# Altium project CG_65_PCB.PrjPcb
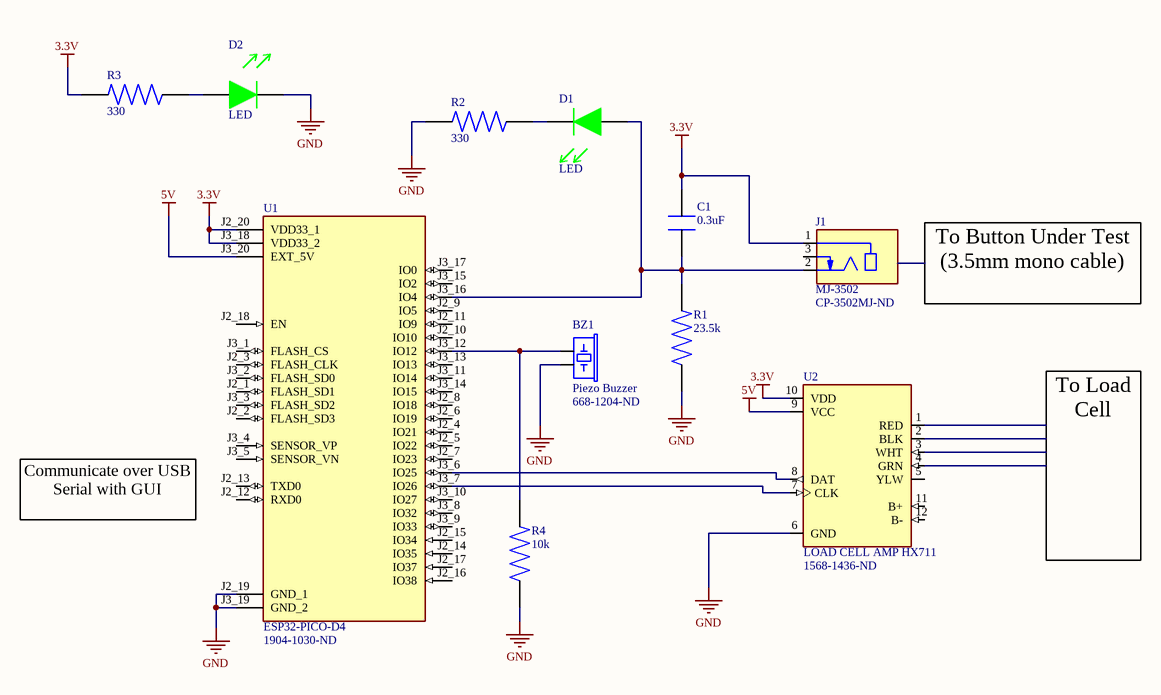
[diagram p0: pcb.SchDoc]
1 sheet, 11 parts. Net scope: global (net labels, ports and power ports of the same name join across sheets).

## Sheet pcb.SchDoc
size A4; SheetNumber: 1; SheetTotal: 1

### Parts
BZ1  Piezo Buzzer  Supplier Part Number 1: 668-1204-ND  [AI-3035-TWT-3V-R]
C1  0.3uF  [NET_TIE-12]
D1  LED  [NET_TIE-12]
D2  LED  [NET_TIE-12]
J1  MJ-3502  Supplier Part Number 1: CP-3502MJ-ND  [NET_TIE-12]
R1  23.5k  [NET_TIE-12]
R2  330  [NET_TIE-12]
R3  330  [NET_TIE-12]
R4  10k  [NET_TIE-12]
U1  ESP32-PICO-D4  Supplier Part Number 1: 1904-1030-ND
U2  LOAD CELL AMP HX711  Supplier Part Number 1: 1568-1436-ND

### Nets
3.3V: C1.0 J1.1 R3.2 U1.J2_20(VDD33_1) U1.J3_18(VDD33_2) U2.10(VDD)
5V: U1.J3_20(EXT_5V) U2.9(VCC)
GND: BZ1.P$3 D2.1 R1.1 R2.2 R4.1 U1.J2_19(GND_1) U1.J3_19(GND_2) U2.6(GND)
NetBZ1_P$2: BZ1.P$2 R4.2 U1.J3_12(IO12)
NetC1_1: C1.1 D1.0 J1.2 R1.2 U1.J3_16(IO4)
NetD1_1: D1.1 R2.1
NetD2_0: D2.0 R3.1
NetU1_J3_6: U1.J3_6(IO25) U2.8(DAT)
NetU1_J3_7: U1.J3_7(IO26) U2.7(CLK)

Not connected (* = marked no-connect by the designer): J1 3; U1 J2_1(FLASH_SD1) J2_2(FLASH_SD3) J2_3(FLASH_CLK) J2_4(IO21) J2_5(IO22) J2_6(IO19) J2_7(IO23) J2_8(IO18) J2_9(IO5) J2_10(IO10) J2_11(IO9) J2_12(RXD0) J2_13(TXD0) J2_14(IO35) J2_15(IO34) J2_16(IO38) J2_17(IO37) J2_18(EN) J3_1(FLASH_CS) J3_2(FLASH_SD0) J3_3(FLASH_SD2) J3_4(SENSOR_VP) J3_5(SENSOR_VN) J3_8(IO32) J3_9(IO33) J3_10(IO27) J3_11(IO14) J3_13(IO13) J3_14(IO15) J3_15(IO2) J3_17(IO0); U2 1(RED) 2(BLK) 3(WHT) 4(GRN) 5(YLW) 11(B+) 12(B-)

### Notes on the sheet
- To Button Under Test (3.5mm mono cable)
- Communicate over USB Serial with GUI
- To Load Cell

### Library data of the parts
BZ1 = BUZZER: Audio Indicator Piezo 2VDC 5VDC 9mA 3VDC 100dBAdBA 3000Hz to 4000Hz Through Hole Pin; Manufacturer: Projects Unlimited; Nominal Supply Voltage (DC): 3V; Frequency: 3.5kHz; Max Supply Voltage (DC): 5V; Min Supply Voltage (DC): 2V; Input Type: DC; Washable: Yes; Supplier 1: Digi-Key; Manufacturer Part Number: AI-3035-TWT-3V-R; RoHS: Yes; Category: Audio Products; Stock 1: 14193; Pricing 1: 1=2.78000, 10=2.30300, 25=2.12600, 50=1.99760, 100=1.87400, 450=1.60551, 950=1.58793 (USD); Mount: Through Hole; Contact Plating: Tin; Min Operating Temperature: -20°C; Max Operating Temperature: 80°C; Package Quantity: 50; Packaging: Tray; Voltage Rating (DC): 3V; Current Rating: 9mA; Operating Supply Current: 9mA; Termination: PC Pins; Max Supply Current: 9mA; Series: AI; Diameter: 30mm; Length: 30mm; Width: 30mm; Height: 20.5mm; ComponentLink1URL: https://datasheet.ciiva.com/8113/ai-3035-twt-3v-r-8113514.pdf?src-supplier=Avnet; ComponentLink1Description: https://datasheet.ciiva.com/8113/ai-3035-twt-3v-r-8113514.pdf?src-supplier=Avnet; ComponentLink2URL: https://datasheet.ciiva.com/4623/ai-3035-twt-3v-r-63144-4623167.pdf?src-supplier=Mouser; ComponentLink2Description: https://datasheet.ciiva.com/4623/ai-3035-twt-3v-r-63144-4623167.pdf?src-supplier=Mouser; ComponentLink3URL: https://datasheet.ciiva.com/0/ai-3035-twt-3v-r-348.pdf?src-supplier=Digi-Key; ComponentLink3Description: https://datasheet.ciiva.com/0/ai-3035-twt-3v-r-348.pdf?src-supplier=Digi-Key
C1 = CAP
J1 = MJ-3502: 3.5 mm, Mono, Right Angle, Through Hole, Threaded Bushing, Audio Jack Connector; Manufacturer: CUI; Body Material: Brass; Body Color: Black; Gender: Female; Shielding: Unshielded; Current Rating: 1A; Number of Conductors: 2; Number of Ports: 1; Supplier 1: Digi-Key; Manufacturer Part Number: MJ-3502; RoHS: Yes; Category: Uncategorized; Mount: Through Hole,Panel; Color: Black; Contact Plating: Silver; Series: -; Packaging: Bulk; Termination: Solder; Orientation: Horizontal; Connector Type: Jack; Diameter: 3.5mm; Lead Free: Lead Free; ComponentLink1URL: https://www.cui.com/product/resource/digikeypdf/mj-3502.pdf?src-supplier=Digi-Key; ComponentLink1Description: https://www.cui.com/product/resource/digikeypdf/mj-3502.pdf?src-supplier=Digi-Key
R1-R4 = RES
U1 = ESP32-PICO-KIT: ESP32 Wifi Bluetooth Eval Board; Manufacturer: Espressif Systems; Frequency: 2.4GHz; Supplier 1: Digi-Key; Manufacturer Part Number: ESP32-PICO-KIT; RoHS: No; Category: RF Semiconductors and Devices; Stock 1: 467; Pricing 1: 1=10.00000 (USD); ComponentLink1URL: https://esp-idf.readthedocs.io/en/latest/get-started/get-started-pico-kit.html?src-supplier=Digi-Key; ComponentLink1Description: https://esp-idf.readthedocs.io/en/latest/get-started/get-started-pico-kit.html?src-supplier=Digi-Key
U2 = LOAD CELL AMP HX711: HX711 Load Cell Amplifier; Manufacturer: SparkFun; Manufacturer Part Number: SEN-13879; Output Type: Digital; Operating Supply Current: 1.5mA; Supplier 1: Digi-Key; RoHS: No; Stock 1: 1086; Pricing 1: 1=10.95000 (USD); Min Operating Temperature: -45°C; Max Operating Temperature: 85°C